# EAGLE schematic Power_Distro_PCB (EAGLE 8.3.2)
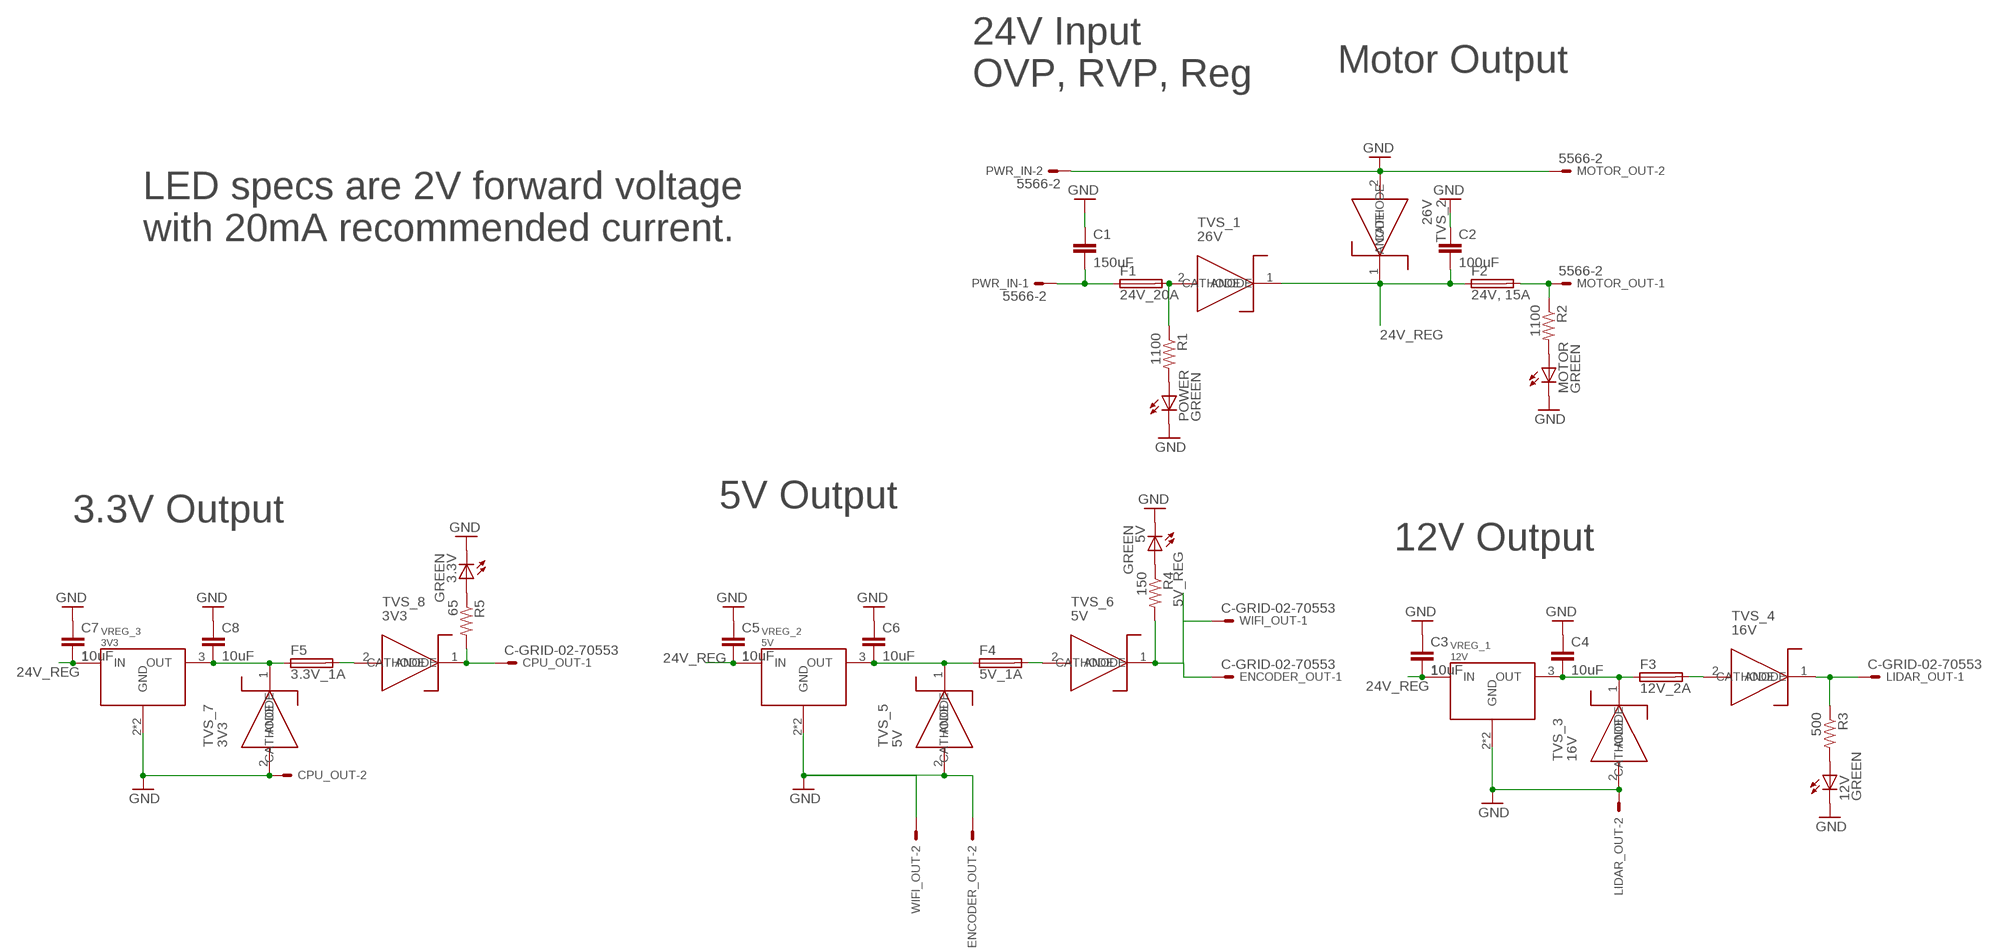
[diagram p0: schematic, sheet 1]

## Parts
3.3V  GREEN  LEDSML1206  [SML1206]
5V  GREEN  LEDSML1206  [SML1206]
12V  GREEN  LEDSML1206  [SML1206]
C1  150uF  C-EUC1206  [C1206]
C2  100uF  C-EUC1206  [C1206]
C3  10uF  C-EUC1206  [C1206]
C4  10uF  C-EUC1206  [C1206]
C5  10uF  C-EUC1206  [C1206]
C6  10uF  C-EUC1206  [C1206]
C7  10uF  C-EUC1206  [C1206]
C8  10uF  C-EUC1206  [C1206]
CPU_OUT  C-GRID-02-70553  [70553-02]
ENCODER_OUT  C-GRID-02-70553  [70553-02]
F1  24V_20A  TE5  [TE5]
F2  24V, 15A  TE5  [TE5]
F3  12V_2A  TE5  [TE5]
F4  5V_1A  TE5  [TE5]
F5  3.3V_1A  TE5  [TE5]
LIDAR_OUT  C-GRID-02-70553  [70553-02]
MOTOR  GREEN  LEDSML1206  [SML1206]
MOTOR_OUT  5566-2  [5566-2]
POWER  GREEN  LEDSML1206  [SML1206]
PWR_IN  5566-2  [5566-2]
R1  1100  R-US_R1206  [R1206]
R2  1100  R-US_R1206  [R1206]
R3  500  R-US_R1206  [R1206]
R4  150  R-US_R1206  [R1206]
R5  65  R-US_R1206  [R1206]
TVS_1  26V  SMAJ26A_TVSSMA  [DO-214AC]
TVS_2  26V  SMAJ26A_TVSSMA  [DO-214AC]
TVS_3  16V  PRSMA16_TVS  [DO-214AC]
TVS_4  16V  PRSMA16_TVS  [DO-214AC]
TVS_5  5V  SMAJ5.0_TVSSMA  [DO-214AC]
TVS_6  5V  SMAJ5.0_TVSSMA  [DO-214AC]
TVS_7  3V3  SMBJ3V3_TVSSMB  [DO-214AA]
TVS_8  3V3  SMBJ3V3_TVSSMB  [DO-214AA]
VREG_1  12V  HIGH-CURRENT_REGSMA  [TO-263-3]
VREG_2  5V  HIGH-CURRENT_REGSMA  [TO-263-3]
VREG_3  3V3  HIGH-CURRENT_REGSMA  [TO-263-3]
WIFI_OUT  C-GRID-02-70553  [70553-02]

## Nets
5V_REG: ENCODER_OUT.1 R4.2 TVS_6.1(CATHODE) WIFI_OUT.1
12V_REG: LIDAR_OUT.1 R3.1 TVS_4.1(CATHODE)
24V_REG: C2.2 C3.2 C5.2 C7.2 F2.1 TVS_1.1(CATHODE) TVS_2.1(CATHODE) VREG_1.1(IN) VREG_2.1(IN) VREG_3.1(IN)
24V_REG_MOTOR: F2.2 MOTOR_OUT.1 R2.1
GND: 3.3V.C 5V.C 12V.C C1.1 C2.1 C3.1 C4.1 C5.1 C6.1 C7.1 C8.1 CPU_OUT.2 ENCODER_OUT.2 LIDAR_OUT.2 MOTOR.C MOTOR_OUT.2 POWER.C PWR_IN.2 TVS_2.2(ANODE) TVS_3.2(ANODE) TVS_5.2(ANODE) TVS_7.2(ANODE) VREG_1.2(GND) VREG_1.4(GND) VREG_2.2(GND) VREG_2.4(GND) VREG_3.2(GND) VREG_3.4(GND) WIFI_OUT.2
N$1: POWER.A R1.2
N$2: 12V.A R3.2
N$3: C1.2 F1.1 PWR_IN.1
N$4: F5.2 TVS_8.2(ANODE)
N$5: CPU_OUT.1 R5.2 TVS_8.1(CATHODE)
N$6: C8.2 F5.1 TVS_7.1(CATHODE) VREG_3.3(OUT)
N$7: C6.2 F4.1 TVS_5.1(CATHODE) VREG_2.3(OUT)
N$8: MOTOR.A R2.2
N$9: F1.2 R1.1 TVS_1.2(ANODE)
N$10: C4.2 F3.1 TVS_3.1(CATHODE) VREG_1.3(OUT)
N$11: F4.2 TVS_6.2(ANODE)
N$17: F3.2 TVS_4.2(ANODE)
N$18: 3.3V.A R5.1
N$20: 5V.A R4.1

## Notes on the sheet
- Motor Output
- 24V Input 
  OVP, RVP, Reg
- LED specs are 2V forward voltage 
  with 20mA recommended current.
- 5V Output
- 3.3V Output
- 12V Output

## Library data of the parts
3.3V 5V 12V MOTOR POWER = led:LED: LED OSRAM: - CHIPLED LG R971, LG N971, LY N971, LG Q971, LY Q971, LO R971, LY R971 LH N974, LH R974 LS Q976, LO Q976, LY Q976 LO Q996 - Hyper CHIPLED LW Q18S LB Q993, LB Q99A, LB R99A - SideLED LS A670, LO A670, LY A670, LG A670, LP A670 LB A673, LV A673, LT A673, LW A673 LH A674 LY A675 LS A676, LA A676, LO A676, LY A676, LW A676 LS A679, LY A679, LG A679 - Hyper Micro SIDELED® LS Y876, LA Y876, LO Y876, LY Y876 LT Y87S - SmartLED LW L88C, LW L88S LB L89C, LB L89S, LG L890 LS L89K, LO L89K, LY L89K LS L896, LA L896, LO L896, LY L896 - TOPLED LS T670, LO T670, LY T670, LG T670, LP T670 LSG T670, LSP T670, LSY T670, LOP T670, LYG T670 LG T671, LOG T671, LSG T671 LB T673, LV T673, LT T673, LW T673 LH T674 LS T676, LA T676, LO T676, LY T676, LB T676, LH T676, LSB T676, LW T676 LB T67C, LV T67C, LT T67C, LS T67K, LO T67K, LY T67K, LW E67C LS E67B, LA E67B, LO E67B, LY E67B, LB E67C, LV E67C, LT E67C LW T67C LS T679, LY T679, LG T679 LS T770, LO T770, LY T770, LG T770, LP T770 LB T773, LV T773, LT T773, LW T773 LH T774 LS E675, LA E675, LY E675, LS T675 LS T776, LA T776, LO T776, LY T776, LB T776 LHGB T686 LT T68C, LB T68C - Hyper Mini TOPLED® LB M676 - Mini TOPLED Santana® LG M470 LS M47K, LO M47K, LY M47K Source: http://www.osram.convergy.de LUXEON: - LUMILED® LXK2-PW12-R00, LXK2-PW12-S00, LXK2-PW14-U00, LXK2-PW14-V00 LXK2-PM12-R00, LXK2-PM12-S00, LXK2-PM14-U00 LXK2-PE12-Q00, LXK2-PE12-R00, LXK2-PE12-S00, LXK2-PE14-T00, LXK2-PE14-U00 LXK2-PB12-K00, LXK2-PB12-L00, LXK2-PB12-M00, LXK2-PB14-N00, LXK2-PB14-P00, LXK2-PB14-Q00 LXK2-PR12-L00, LXK2-PR12-M00, LXK2-PR14-Q00, LXK2-PR14-R00 LXK2-PD12-Q00, LXK2-PD12-R00, LXK2-PD12-S00 LXK2-PH12-R00, LXK2-PH12-S00 LXK2-PL12-P00, LXK2-PL12-Q00, LXK2-PL12-R00 Source: www.luxeon.com KINGBRIGHT: KA-3528ASYC Source: www.kingbright.com
C1-C8 = resistor:C-EU: CAPACITOR, European symbol
CPU_OUT ENCODER_OUT LIDAR_OUT WIFI_OUT = con-molex:C-GRID-02: CONNECTOR wire to board 2.54 mm (0.100") pitch header; OC_FARNELL: unknown; OC_NEWARK: unknown
F1-F5 = fuse:TE5: FUSE Wickmann; OC_FARNELL: unknown; OC_NEWARK: unknown
MOTOR_OUT PWR_IN = con-molex:5566-2: Mini FIT connector 2 pol Source: http://www.molex.com; OC_FARNELL: 1822072; OC_NEWARK: unknown
R1-R5 = resistor:R-US_: RESISTOR, American symbol
TVS_1 TVS_2 = POWER_DISTRO:SMAJ26A_TVS: TVS Diode, SMAJ26A
TVS_3 TVS_4 = POWER_DISTRO:PRSMA16_TVS: TVS Diode, PRSMA16
TVS_5 TVS_6 = POWER_DISTRO:SMAJ5.0_TVS: TVS Diode, SMAJ Series
TVS_7 TVS_8 = POWER_DISTRO:SMBJ3V3_TVS: SMBJ_3.3, TVS Diode
VREG_1-VREG_3 = POWER_DISTRO:HIGH-CURRENT_REG: MIC29X, High Voltage Reg.

## Net classes
0 default: width 0.025 mm, drill 0.254 mm, clearance 0.254 mm
1 Power IN: width 4.801 mm
2 Motor_OUT: width 4.801 mm
3 3.3V_1A: width 0.305 mm
4 5V_1A: width 0.305 mm
5 12V_2A: width 0.813 mm